# EAGLE design AT85_Power_SW_01A_H1.0 (EAGLE 8.2.1)
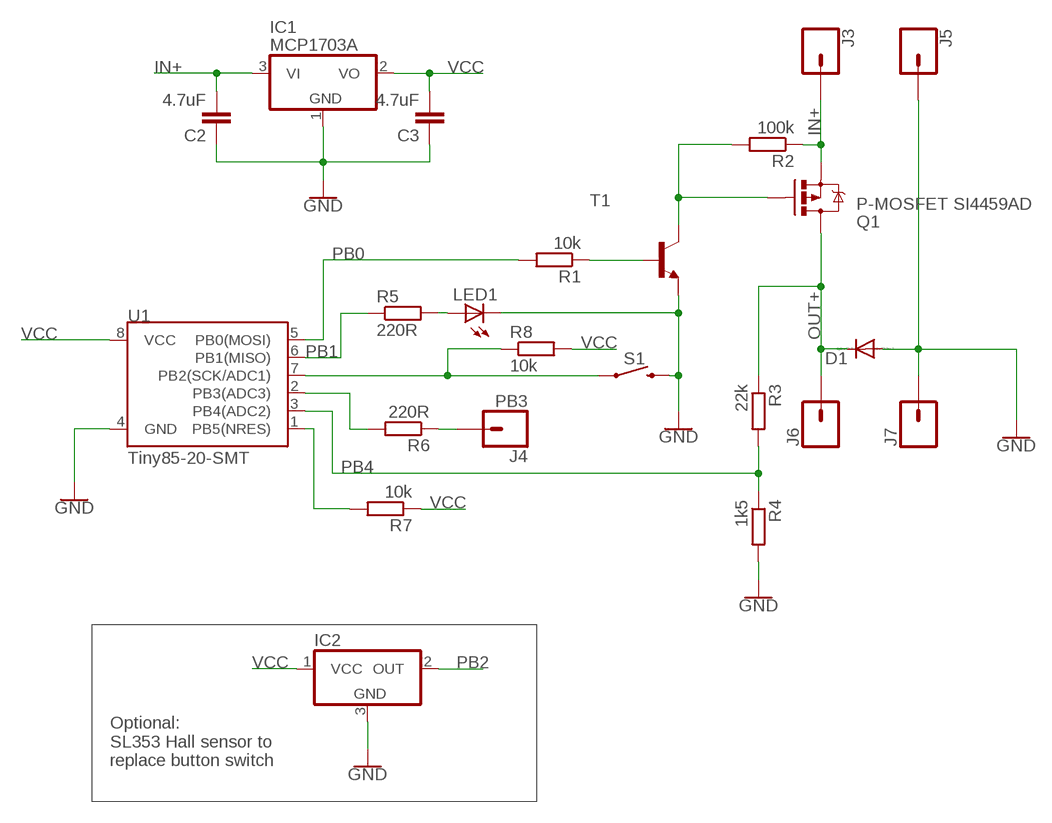
[diagram p0: schematic, sheet 1]

## Parts
C2  4.7uF  CAP_SMD_C0805  [C0805]
C3  4.7uF  CAP_SMD_C0805  [C0805]
D1  DIODE-DO-214AC  [DO-214AC]
IC1  MCP1703A  MCP1703CB  [SOT23]
IC2  SL353  [SOT23]
J3  CONN_01PTH_LONGPAD  [1X01_LONGPAD]
J4  PB3  CONN_01  [1X01]
J5  CONN_01PTH_LONGPAD  [1X01_LONGPAD]
J6  CONN_01PTH_LONGPAD  [1X01_LONGPAD]
J7  CONN_01PTH_LONGPAD  [1X01_LONGPAD]
LED1  LED3MM  [LED3MM]
Q1  P-MOSFET SI4459AD  MOSFET-PCHANNELFDS6675  [SO08]
R1  10k  RESISTOR_SMDR0805  [R0805]
R2  100k  RESISTOR_SMDR0805  [R0805]
R3  22k  RESISTOR_SMDR0805  [R0805]
R4  1k5  RESISTOR_SMDR0805  [R0805]
R5  220R  RESISTOR_SMDR0805  [R0805]
R6  220R  RESISTOR_SMDR0805  [R0805]
R7  10k  RESISTOR_SMDR0805  [R0805]
R8  10k  RESISTOR_SMDR0805  [R0805]
S1  MOMENTARY-SWITCH-SPST-SMD-6.2MM-TALL  [TACTILE_SWITCH_SMD_6.2MM_TALL]
T1  MMBT2222ALT1-NPN-SOT23-BEC  [SOT23-BEC]
U1  Tiny85-20-SMT  ATTINY45TINY85-20-SMT  [SO08-EIAJ_MCU]

## Nets
GATE: Q1.4(G) R2.2 T1.C
GND: C2.1 C3.1 D1.A IC1.1(GND) IC2.3(GND) J5.1 J7.1 LED1.K(C) R4.2 S1.B2 T1.E U1.4(GND)
IN+: C2.2 IC1.3(VI) J3.1 Q1.1(S) Q1.2(S) Q1.3(S) R2.1
N$2: LED1.A R5.2
N$3: R1.1 T1.B
OUT+: D1.C J6.1 Q1.5(D) Q1.6(D) Q1.7(D) Q1.8(D) R3.1
PB0: R1.2 U1.5(PB0(MOSI))
PB1: R5.1 U1.6(PB1(MISO))
PB2: IC2.2(OUT) R8.1 S1.A2 U1.7(PB2(SCK/ADC1))
PB3: R6.2 U1.2(PB3(ADC3))
PB3_: J4.1 R6.1
PB4: R3.2 R4.1 U1.3(PB4(ADC2))
RST: R7.2 U1.1(PB5(NRES))
VCC: C3.2 IC1.2(VO) IC2.1(VCC) R7.1 R8.2 U1.8(VCC)

## Notes on the sheet
- Optional:
  SL353 Hall sensor to 
  replace button switch

## Library data of the parts
C2 C3 = OKA-Cap-Resistor:CAP_SMD
D1 = diode:DIODE-: DIODE
IC1 = linear:MCP1703: 250 mA, 16V, Low Quiescent Current LDO Regulator Source: http://ww1.microchip.com/downloads/en/DeviceDoc/22049b.pdf
IC2 = OKA-IC:SL353: Hall switch
J3-J7 = SparkFun-Connectors:CONN_01: Single connection point. Often used as Generic Header-pin footprint for 0.1 inch spaced/style header connections On any of the 0.1 inch spaced packages, you can populate with these: Break Away Headers - Straight <https://www.sparkfun.com/products/116> (PRT-00116) Break Away Male Headers - Right Angle <https://www.sparkfun.com/products/553> (PRT-00553) Female Headers <https://www.sparkfun.com/products/115> (PRT-00115) Break Away Headers - Machine Pin <https://www.sparkfun.com/products/117> (PRT-00117) Break Away Female Headers - Swiss Machine Pin <https://www.sparkfun.com/products/743> (PRT-00743) This device is also useful as a general connection point to wire up your design to another part of your project. Our various solder wires solder well into these plated through hole pads. Hook-Up Wire - Assortment (Stranded, 22 AWG) <https://www.sparkfun.com/products/11375> (PRT-11375) Hook-Up Wire - Assortment (Solid Core, 22 AWG) <https://www.sparkfun.com/products/11367> (PRT-11367) View the entire wire category on our website here <https://www.sparkfun.com/categories/141> Special notes: SMTSO-256-ET is a "flush mount" nut for a 4-40 screw. We mostly use this on specialty testbeds; it is a nice way to connect hardware to your PCB at an adjustable hieght. Also note, the SNAP packages are for using a snappable style connector. We sell a baggie of snaps and they are also used on two LilyPad designs: Snap Assortment - 30 pack (male and female) <https://www.sparkfun.com/products/11347> (DEV-11347) LilyPad Arduino SimpleSnap <https://www.sparkfun.com/products/10941> (DEV-10941) LilyPad SimpleSnap Protoboard <https://www.sparkfun.com/products/10940> (DEV-10940)
LED1 = adafruit:LED: LED OSRAM: - CHIPLED LG R971, LG N971, LY N971, LG Q971, LY Q971, LO R971, LY R971 LH N974, LH R974 LS Q976, LO Q976, LY Q976 LO Q996 - Hyper CHIPLED LW Q18S LB Q993, LB Q99A, LB R99A - SideLED LS A670, LO A670, LY A670, LG A670, LP A670 LB A673, LV A673, LT A673, LW A673 LH A674 LY A675 LS A676, LA A676, LO A676, LY A676, LW A676 LS A679, LY A679, LG A679 - Hyper Micro SIDELED® LS Y876, LA Y876, LO Y876, LY Y876 LT Y87S - SmartLED LW L88C, LW L88S LB L89C, LB L89S, LG L890 LS L89K, LO L89K, LY L89K LS L896, LA L896, LO L896, LY L896 - TOPLED LS T670, LO T670, LY T670, LG T670, LP T670 LSG T670, LSP T670, LSY T670, LOP T670, LYG T670 LG T671, LOG T671, LSG T671 LB T673, LV T673, LT T673, LW T673 LH T674 LS T676, LA T676, LO T676, LY T676, LB T676, LH T676, LSB T676, LW T676 LB T67C, LV T67C, LT T67C, LS T67K, LO T67K, LY T67K, LW E67C LS E67B, LA E67B, LO E67B, LY E67B, LB E67C, LV E67C, LT E67C LW T67C LS T679, LY T679, LG T679 LS T770, LO T770, LY T770, LG T770, LP T770 LB T773, LV T773, LT T773, LW T773 LH T774 LS E675, LA E675, LY E675, LS T675 LS T776, LA T776, LO T776, LY T776, LB T776 LHGB T686 LT T68C, LB T68C - Hyper Mini TOPLED® LB M676 - Mini TOPLED Santana® LG M470 LS M47K, LO M47K, LY M47K Source: http://www.osram.convergy.de/
Q1 = User-Submitted:MOSFET-PCHANNEL: Generic PMOSFET IRLML2244 - TRANS-11153 (SOT-23 -20V -4.3A) (1.Gate 2.Source 3.Drain) FQP27P06 - COM-10349 <http://www.sparkfun.com/products/10349> (TO-220 -60V -27A) (1.Gate 2.Source 3.Drain)
R1-R8 = OKA-Cap-Resistor:RESISTOR_SMD
S1 = SparkFun-Switches:MOMENTARY-SWITCH-SPST: Momentary Switch (Pushbutton) - SPST Normally-open (NO) SPST momentary switches (buttons, pushbuttons). Variants PTH-12MM - 12mm square, through-hole Momentary Pushbutton Switch - 12mm Square <https://www.sparkfun.com/products/9190> (COM-09190) PTH-6.0MM, PTH-6.0MM-KIT - 6.0mm square, through-hole Mini Pushbutton Switch <https://www.sparkfun.com/products/97> (COM-00097) KIT package intended for soldering kit's - only one side of pads' copper is exposed. PTH-RIGHT-ANGLE-KIT - Right-angle, through-hole Right Angle Tactile Button <https://www.sparkfun.com/products/10791> - Used on SparkFun BigTime Watch Kit <https://www.sparkfun.com/products/11734> SMD-12MM - 12mm square, surface-mount Tactile Button - SMD (12mm) <https://www.sparkfun.com/products/12993> (COM-12993) Used on SparkFun PicoBoard <https://www.sparkfun.com/products/11888> SMD-4.5MM - 4.5mm Square Trackball Switch Used on SparkFun Blackberry Trackballer Breakout <https://www.sparkfun.com/products/13169> SMD-4.6MMX2.8MM - 4.60mm x 2.80mm, surface mount Used on SparkFun SAMD21 Mini Breakout <https://www.sparkfun.com/products/13664> SMD-5.2MM, SMD-5.2-REDUNDANT - 5.2mm square, surface-mount Mini Pushbutton Switch - SMD <https://www.sparkfun.com/products/8720> (COM-08720) Used on Arduino Pro Mini <https://www.sparkfun.com/products/11114> REDUNDANT package connects both switch circuits together SMD-6.0X3.5MM - 6.0 x 3.5mm, surface mount Momentary Reset Switch SMD <https://www.sparkfun.com/products/8229> (COM-08229) SMD-6.2MM-TALL - 6.2mm square, surface mount Tactile Button - SMD (6mm) <https://www.sparkfun.com/products/12992> Used on SparkFun Digital Sandbox <https://www.sparkfun.com/products/12651> SMD-RIGHT-ANGLE - Right-angle, surface mount Used on SparkFun Block for Intel® Edison - Arduino <https://www.sparkfun.com/products/13036>; PROD_ID: SWCH-11966; SF_SKU: COM-12992
T1 = transistor:*-NPN-: NPN Transistror BF959 corrected 2008.03.06
U1 = SparkFun-Retired:ATTINY45: Atmel 8-pin 2/4/8kB flash uC Retired; PROD_ID: IC-09092

## Board
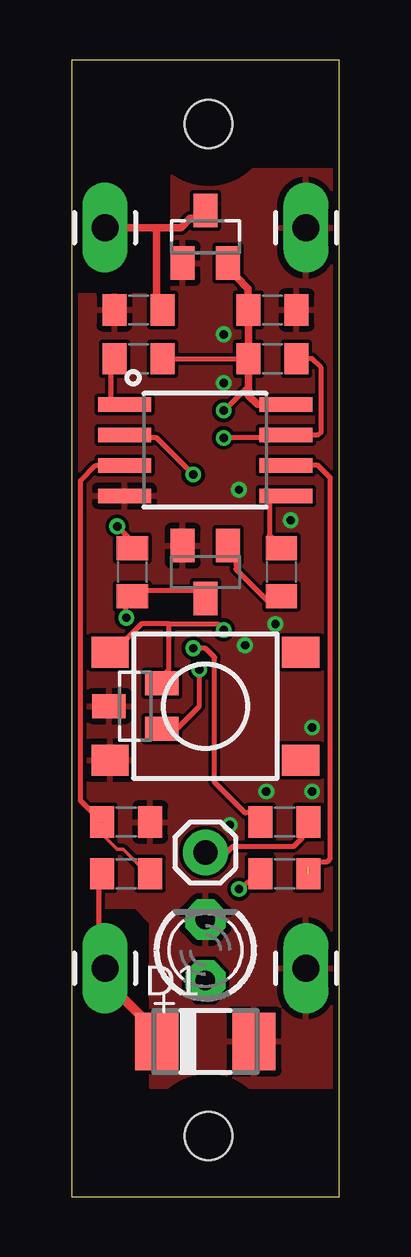
[diagram p1: board, top side]
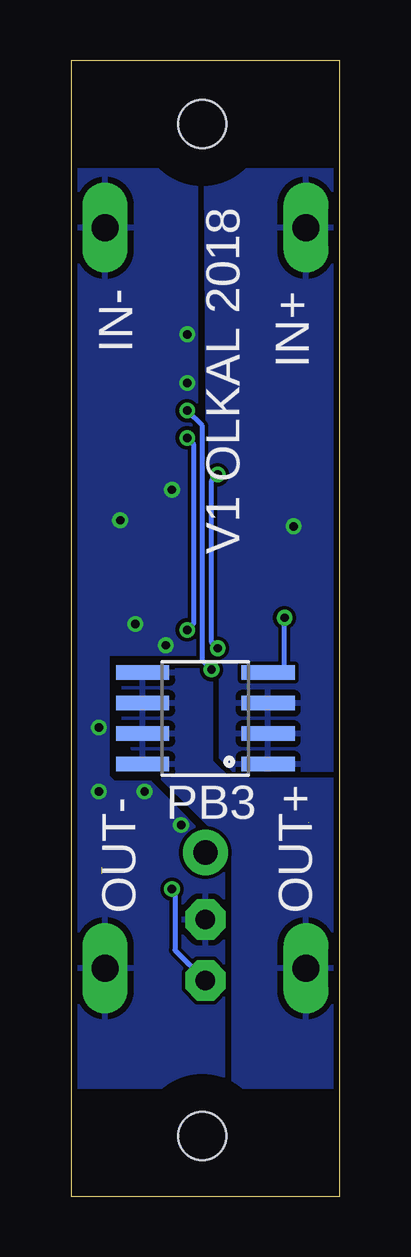
[diagram p2: board, bottom side, seen from below]

Size 11.18 x 47.37 mm. Coordinates in mm from the lower left corner, seen from the top.
Outline: 0,0 11.18,0 11.18,47.37 0,47.36 0,0
Copper layers (1*16): Top 0.035mm / dielectric 1.5mm / Bottom 0.035mm
Design rules "SeeedStudio_2layer_DRU_no_angle_20140221": minimum track width 6mil, minimum drill 12mil, track to track 6mil, track to pad 6mil, pad to pad 6mil, via to via 6mil, smd to smd 0mil, copper to edge 10mil, drill to drill 10mil, minimum pad ring 10mil, minimum via ring 6mil, stop-mask expansion 2mil, vias tented up to drill 100mil, thermal gap 10mil
Holes 2 mm at 5.71,44.7 5.71,2.54
tRestrict: area 3.2,42.2 to 8.2,47.2; area 3.2,0 to 8.2,5
bRestrict: area 3.2,42.2 to 8.2,47.2; area 3.2,0 to 8.2,5

### Footprints (pad centres in the part's own frame; a part is rotated, then mirrored left to right if it is on the bottom)
C0805 = smd 1 x 1.3: 1 -1,0; 2 1,0
DO-214AC = smd 1.8 x 2.4: A 2.025,0; C -2.025,0
SOT23 = smd 1 x 1.4: 1 -0.95,-1.1; 2 0.95,-1.1; 3 0,1.1
1X01_LONGPAD = drill 1.118 pad 1.88 long: 1 0,0
1X01 = drill 1.016 pad 1.88: 1 0,0
LED3MM = drill 0.813 pad 1.676 octagon: A -1.27,0; K 1.27,0
SO08 = smd 0.61 x 2.21: 1 -1.905,-2.616; 2 -0.635,-2.616; 3 0.635,-2.616; 4 1.905,-2.616; 5 1.905,2.616; 6 0.635,2.616; 7 -0.635,2.616; 8 -1.905,2.616
R0805 = smd 1 x 1.3: 1 -1,0; 2 1,0
TACTILE_SWITCH_SMD_6.2MM_TALL = smd 1.55 x 1.3: A1 -3.975,-2.25; A2 3.975,-2.25; B1 -3.975,2.25; B2 3.975,2.25
SOT23-BEC = smd 1 x 1.4: B -0.95,-1.1; C 0,1.1; E 0.95,-1.1
SO08-EIAJ_MCU = smd 0.61 x 2.21: 1 -1.905,-3.378; 2 -0.635,-3.378; 3 0.635,-3.378; 4 1.905,-3.378; 5 1.905,3.353; 6 0.635,3.353; 7 -0.635,3.353; 8 -1.905,3.353

### Placement (x,y rotation side)
C2  2.79,36.96 0 top
C3  8.38,36.96 180 top
D1  5.59,6.48 0 top
IC1  5.59,40 0 top
IC2  2.67,20.45 90 top
J3  1.4,40.39 0 top
J4  5.59,14.35 0 top
J5  9.78,40.39 0 top
J6  1.4,9.53 0 top
J7  9.78,9.53 0 top
LED1  5.59,10.29 90 top
Q1  5.59,19.94 90 bottom
R1  8.76,26.04 90 top
R2  2.54,26.04 270 top
R3  2.29,13.46 0 top
R4  2.29,15.62 0 top
R5  8.89,13.46 180 top
R6  8.89,15.62 180 top
R7  2.79,34.92 180 top
R8  8.38,34.92 180 top
S1  5.59,20.45 180 top
T1  5.59,26.04 180 top
U1  5.59,31.12 270 top

### Tracks (layer width: path | path; a pad name or v marks a point on that pad's centre or on a via)
GATE  (via drill 0.35)
  Top 0.203: R2.2 2.81,25.04 3.05,25.27 | 3.05,25.27 2.29,25.27 v2.29,24.13 | 3.05,25.27 5.25,25.27 T1.C
  Bottom 0.203: 2.29,21.89 v2.29,24.13
  Bottom 0.254: 2.41,21.84 Q1.4 2.29,21.89
GND  (via drill 0.35)
  other vias: 7.24,22.99 6.6,15.49 9.14,28.19 6.99,29.46 6.35,33.91 8.51,23.88 6.35,35.94 10.03,16.89 10.03,19.56 8.13,16.89
  pour Top: 0,37.59 4.19,37.59 4.19,42.8 11.18,42.8 11.18,4.57 3.3,4.57 3.3,11.43 2.67,12.06 0,12.06
  pour Bottom: 11.18,4.57 4.83,4.57 4.83,14.22 7.87,17.27 9.4,17.27 9.65,17.53 9.65,22.61 5.97,22.61 5.97,42.8 11.18,42.8
IN+  (via drill 0.35)
  Top 0.203: R2.1 2.54,27.3 v1.91,27.94
  Top 0.305: 3.43,40.39 J3.1 | 3.43,40.39 4.57,40.39 4.95,40.77 5.25,40.77 IC1.3 | C2.2 3.79,37.1 3.56,37.34 3.56,40.26 3.43,40.39
  pour Bottom: 0,42.8 5.59,42.8 5.46,22.61 4.95,22.1 4.95,18.29 4.45,17.78 0,17.78
N$2  (via drill 0.35)
  Top 0.203: R5.2 7.87,13.46 7.49,13.21 v6.99,12.83
  Bottom 0.203: v6.99,12.83 6.86,12.7 6.86,10.29 LED1.A
N$3
  Top 0.203: T1.B 6.54,26.99 6.86,26.67 6.86,26.16 8.26,24.77 8.49,24.77 R1.1
OUT+
  Top 0.203: J6.1 1.14,9.78 1.14,13.32 R3.1
  Top 0.406: D1.C 3.56,6.85 1.4,9.02 J6.1
  pour Bottom: 0,4.57 0,17.4 4.57,17.4 5.33,18.16 5.33,21.97 9.02,21.97 9.02,19.05 4.45,14.48 4.45,4.57
PB0
  Top 0.203: U1.5 8.26,29.08 8.26,27.56 R1.2
PB1  (1 unrouted)
  Top 0.203: 9.89,13.73 9.65,13.97 10.67,13.97 10.79,14.1 10.79,29.97 10.29,30.48 U1.6
PB2  (via drill 0.35)
  Top 0.152: U1.7 8.26,31.75 8.13,31.62 | 2.16,23.11 S1.A2
  Top 0.203: 8.13,31.62 v6.35,31.62 | 4.06,23.88 6.1,23.88 v6.35,23.62 | 4.06,23.88 2.92,23.88 2.16,23.11 | 8.26,31.75 10.29,31.75 10.41,31.88 10.41,34.54 10.03,34.92 R8.1 | IC2.2 3.43,21.72 3.81,21.72 4.06,21.97 4.06,23.88
  Bottom 0.203: v6.35,31.62 6.1,31.37 6.1,23.88 v6.35,23.62
PB3  (via drill 0.35)
  Top 0.203: v5.08,22.86 5.59,22.86 5.97,22.48 5.97,17.27 7.24,16 7.49,16 7.87,15.62 R6.2 | v5.08,30.1 3.56,31.62 2.34,31.62 U1.2
  Bottom 0.203: v5.08,22.86 5.33,23.11 5.33,29.85 v5.08,30.1
PB3_
  Top 0.203: J4.1 6.48,14.35 6.73,14.6 9.27,14.6 9.65,14.99 9.65,15.38 R6.1
PB4  (1 unrouted)
  Top 0.152: R3.2 3.29,13.73 3.03,13.6 2.16,14.48 1.91,14.48 1.27,15.11 1.27,15.51 R4.1
  Top 0.203: 1.27,15.62 0.38,16.51 0.38,29.85 1.02,30.48 U1.3
RST
  Top 0.203: U1.1 1.78,33.02 1.65,33.15 1.65,34.78 R7.2
VCC  (via drill 0.35)
  Top 0.203: R7.1 R8.2 | IC2.1 4.45,19.56 5.33,20.45 v5.33,21.97 | v6.35,32.77 6.37,32.77 7.38,33.78
  Top 0.305: IC1.2 6.86,38.35 7.37,37.85 7.37,36.97 C3.2 R8.2 7.38,33.78 7.38,33.38 7.75,33.02 U1.8
  Bottom 0.203: v5.33,21.97 5.71,22.35 5.71,32.13 v6.35,32.77

### Text on the board
bNames: V1 OLKAL 2018 | IN+ | IN- | PB3 | OUT+ | OUT-